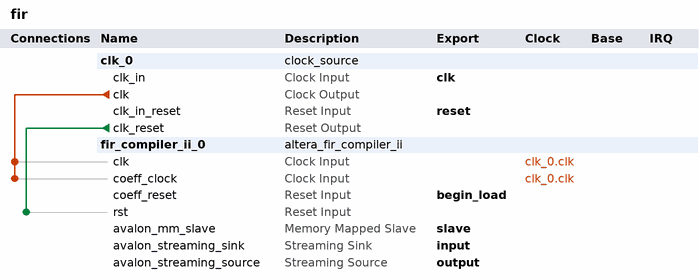
[diagram p0: system contents]
# Platform Designer (Qsys) system fir, Cyclone V 5CSEMA5F31C6
# Parameters at their usual value, and those the tool derives, are not listed.
package require -exact qsys 17.1
create_system fir
set_project_property DEVICE_FAMILY {Cyclone V}
set_project_property DEVICE 5CSEMA5F31C6

add_instance clk_0 clock_source 17.1
set_instance_parameter_value clk_0 clockFrequency 50000000

add_instance fir_compiler_ii_0 altera_fir_compiler_ii 17.1
set_instance_parameter_value fir_compiler_ii_0 coeffBitWidth 16
set_instance_parameter_value fir_compiler_ii_0 coeffFracBitWidth 15
set_instance_parameter_value fir_compiler_ii_0 coeffReload true
set_instance_parameter_value fir_compiler_ii_0 coeffType frac
set_instance_parameter_value fir_compiler_ii_0 inputBitWidth 16
set_instance_parameter_value fir_compiler_ii_0 inputChannelNum 8
set_instance_parameter_value fir_compiler_ii_0 inputFracBitWidth 0
set_instance_parameter_value fir_compiler_ii_0 inputRate 0.048
set_instance_parameter_value fir_compiler_ii_0 inputType int
set_instance_parameter_value fir_compiler_ii_0 outLsbBitRem 7
set_instance_parameter_value fir_compiler_ii_0 outMsbBitRem 0
set_instance_parameter_value fir_compiler_ii_0 outType int
set_instance_parameter_value fir_compiler_ii_0 readWriteMode write
set_instance_parameter_value fir_compiler_ii_0 speedGrade medium

# connections
add_connection clk_0.clk fir_compiler_ii_0.clk clock
add_connection clk_0.clk fir_compiler_ii_0.coeff_clock clock
add_connection clk_0.clk_reset fir_compiler_ii_0.rst reset

# exported interfaces
add_interface begin_load reset sink
set_interface_property begin_load EXPORT_OF fir_compiler_ii_0.coeff_reset
add_interface clk clock sink
set_interface_property clk EXPORT_OF clk_0.clk_in
add_interface input avalon_streaming sink
set_interface_property input EXPORT_OF fir_compiler_ii_0.avalon_streaming_sink
add_interface output avalon_streaming source
set_interface_property output EXPORT_OF fir_compiler_ii_0.avalon_streaming_source
add_interface reset reset sink
set_interface_property reset EXPORT_OF clk_0.clk_in_reset
add_interface slave avalon slave
set_interface_property slave EXPORT_OF fir_compiler_ii_0.avalon_mm_slave

set_interconnect_requirement {$system} qsys_mm.clockCrossingAdapter HANDSHAKE
set_interconnect_requirement {$system} qsys_mm.enableEccProtection FALSE
set_interconnect_requirement {$system} qsys_mm.insertDefaultSlave FALSE
set_interconnect_requirement {$system} qsys_mm.maxAdditionalLatency 1

save_system fir.qsys
